# EAGLE design lief-p0r1 (EAGLE 7.5.0)
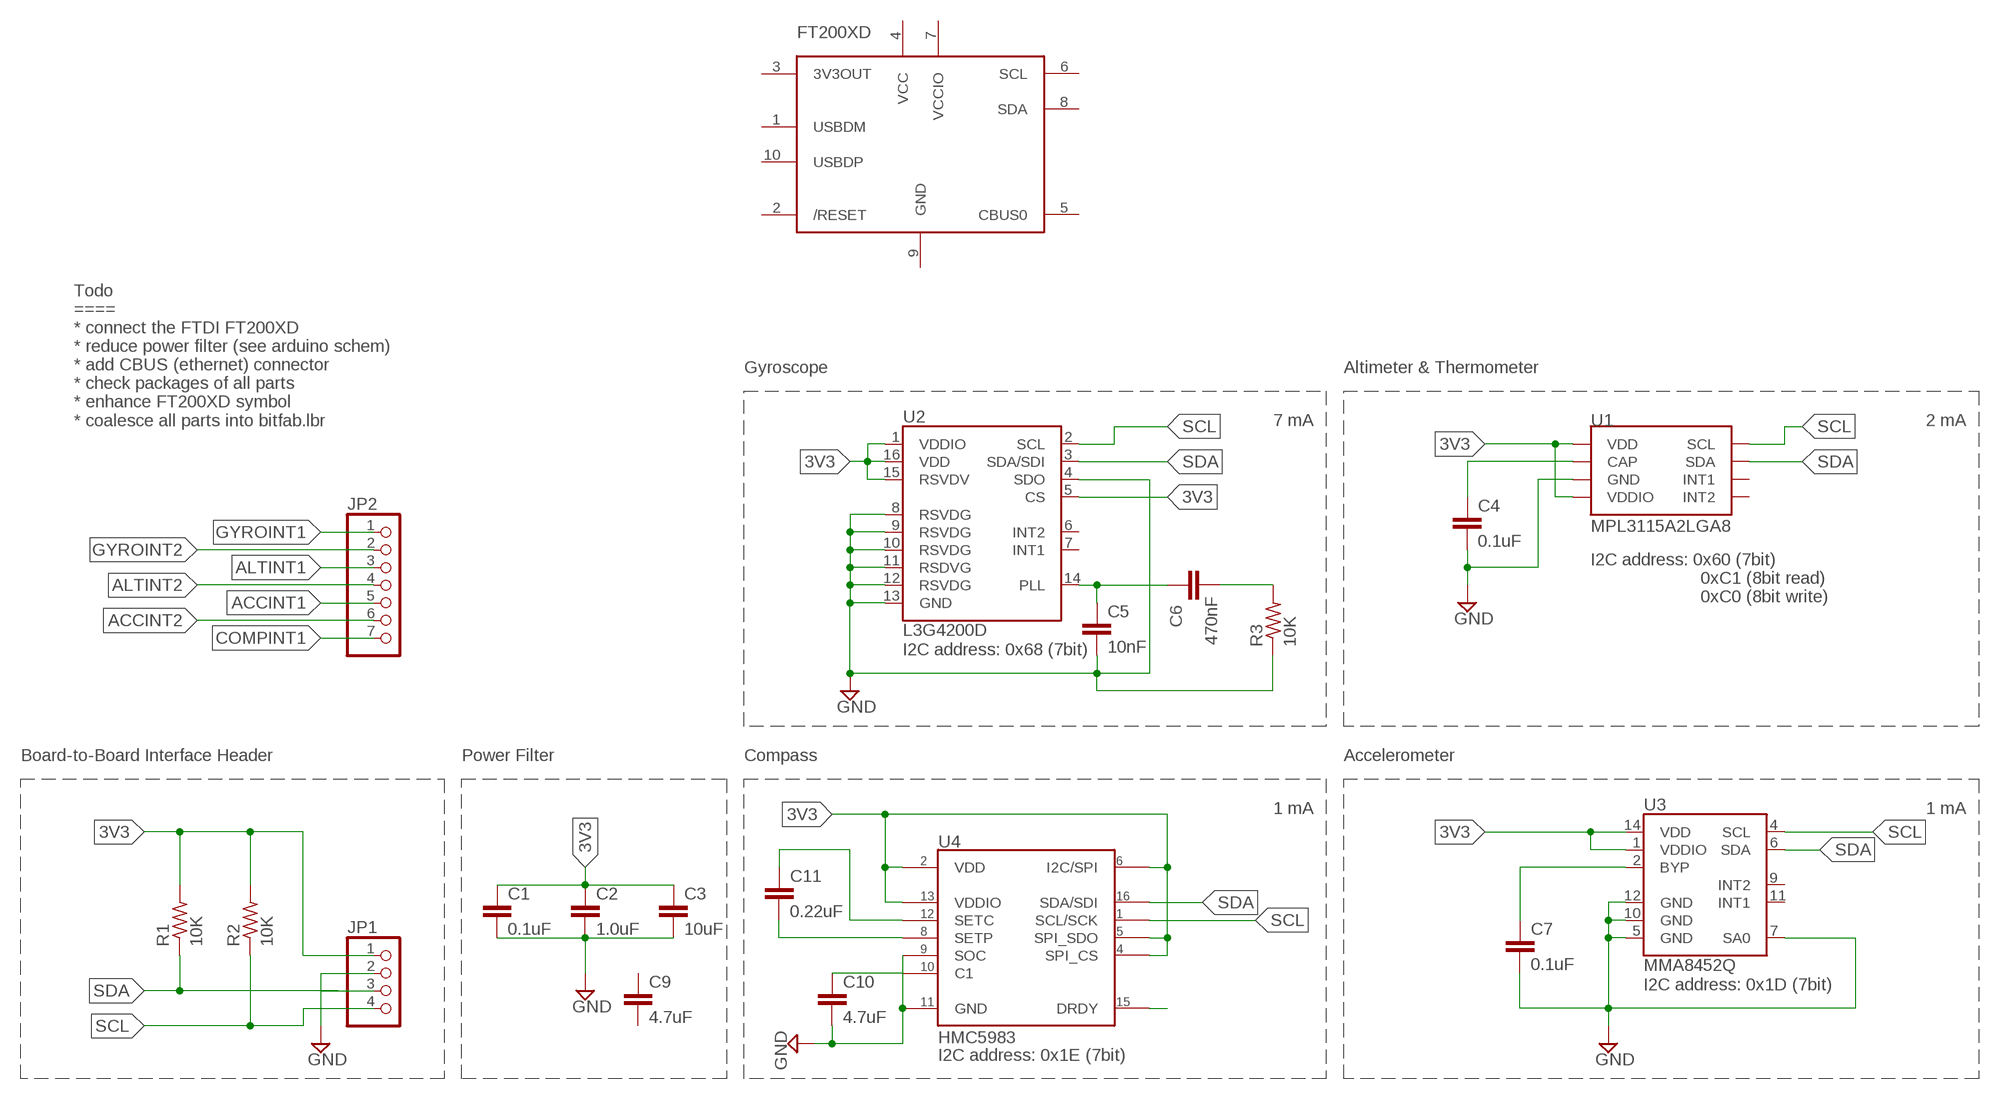
[diagram p0: schematic, sheet 1]

## Parts
C1  0.1uF  0.1UF-25V(+80/-20%)(0603)  [0603-CAP]
C2  1.0uF  1.0UF-25V-+80/-20(0805)"  [0805-CAP]
C3  10uF  1.0UF-25V-+80/-20(0805)"  [0805-CAP]
C4  0.1uF  1.0UF-25V-+80/-20(0805)"  [0805-CAP]
C5  10nF  1.0UF-25V-+80/-20(0805)"  [0805-CAP]
C6  470nF  1.0UF-25V-+80/-20(0805)"  [0805-CAP]
C7  0.1uF  0.1UF-100V-10%(0603)  [0603-CAP]
C9  4.7uF  0.1UF-100V-10%(0603)  [0603-CAP]
C10  4.7uF  1.0UF-25V-+80/-20(0805)"  [0805-CAP]
C11  0.22uF  1.0UF-25V-+80/-20(0805)"  [0805-CAP]
JP1  PINHD-1X4  [1X04]
JP2  PINHD-1X7  [1X07]
R1  10K  R-US_0204/2V  [0204V]
R2  10K  R-US_0204/2V  [0204V]
R3  10K  R-US_0204/2V  [0204V]
U1  MPL3115A2LGA8  [LGA8]
U2  L3G4200D  [LGA16-4X4]
U3  MMA8452Q  [QFN-16_0.5MM]
U4  HMC5983  [HMC5983-LPCC16]
U$1  FT200XD  [DFN-10]

## Nets
3V3: C1.1 C2.1 C3.1 JP1.1 R1.2 R2.2 U1.1(VDD) U1.4(VDDIO) U2.1(VDDIO) U2.5(CS) U2.15(RSVDV) U2.16(VDD) U3.1(VDDIO) U3.14(VDD) U4.I2C/SPI U4.SPI_CS/S1(SPI_CS) U4.SPI_SDO U4.VDD U4.VDDIO
ACCINT1: JP2.5
ACCINT2: JP2.6
ALTINT1: JP2.3
ALTINT2: JP2.4
COMPINT1: JP2.7
GND: C1.2 C2.2 C3.2 C4.2 C5.2 C7.2 C10.2 JP1.2 JP1.3 R3.1 U1.3(GND) U2.4(SDO) U2.8(RSVDG) U2.9(RSVDG) U2.10(RSVDG) U2.11(RSDVG) U2.12(RSVDG) U2.13(GND) U3.5(GND) U3.7(SA0) U3.10(GND) U3.12(GND) U4.GND U4.SOC
GYROINT1: JP2.1
GYROINT2: JP2.2
N$5: C11.1 U4.SETC
N$6: C4.1 U1.2(CAP)
N$7: C6.2 R3.2
N$8: C5.1 C6.1 U2.14(PLL)
N$9: C7.1 U3.2(BYP)
N$10: C11.2 U4.SETP
N$12: C10.1 U4.C1
N$19: U4.DRDY
SCL: JP1.4 R2.1 U1.8(SCL) U2.2(SCL) U3.4(SCL) U4.SCL/SPI_SCK(SCL/SCK)
SDA: R1.1 U1.7(SDA) U2.3(SDA/SDI) U3.6(SDA) U4.SDA/SPI_SDI(SDA/SDI)
Unconnected: C9.1 C9.2 U1.5(INT2) U1.6(INT1) U2.6(INT2) U2.7(INT1) U3.9(INT2) U3.11(INT1) U$1.1(USBDM) U$1.2(/RESET) U$1.3(3V3OUT) U$1.4(VCC) U$1.5(CBUS0) U$1.6(SCL) U$1.7(VCCIO) U$1.8(SDA) U$1.9(GND) U$1.10(USBDP)

## Notes on the sheet
- FT200XD
- Gyroscope | Altimeter & Thermometer
- Todo
  ====
  * connect the FTDI FT200XD
  * reduce power filter (see arduino schem)
  * add CBUS (ethernet) connector
  * check packages of all parts
  * enhance FT200XD symbol
  * coalesce all parts into bitfab.lbr
- 7 mA | 2 mA
- I2C address: 0x60 (7bit)
                        0xC1 (8bit read)
                        0xC0 (8bit write)
- I2C address: 0x68 (7bit)
- Board-to-Board Interface Header | Power Filter | Compass | Accelerometer
- 1 mA | 1 mA
- I2C address: 0x1D (7bit)
- I2C address: 0x1E (7bit)

## Library data of the parts
C1 = SparkFun-Capacitors:0.1UF-25V(+80/-20%)(0603): CAP-00810 Ceramic Standard decoupling cap; PROD_ID: CAP-00810
C2 = SparkFun-Capacitors:1.0UF-25V-+80/-20(0805): CAP-11625; PROD_ID: CAP-11625
C3-C6 C10 C11 = SparkFun-Capacitors:1.0UF-25V-+80/-20(0805): CAP-11625; PROD_ID: CAP-11625; VALUE: 1.0uF
C7 = SparkFun-Capacitors:0.1UF-100V-10%(0603): CAP-08390; PROD_ID: CAP-08390
C9 = SparkFun-Capacitors:0.1UF-100V-10%(0603): CAP-08390; PROD_ID: CAP-08390; VALUE: 0.1uF
JP1 = pinhead:PINHD-1X4: PIN HEADER
JP2 = pinhead:PINHD-1X7: PIN HEADER
R1-R3 = resistor:R-US_: RESISTOR, American symbol
U1 = SparkFun-Sensors:MPL3115A2: Altimeter/Pressure Sensor, I2C, 1.95V-3.6V supply, 50 to 110kPa; PROD_ID: IC-10869
U2 = SparkFun-Sensors:L3G4200D: L3G4200D Three-axis, digital output gyroscope The L3G4200D is a low-power three-axis angular rate sensor, has a full scale of ±250/±500/±2000 dps and is capable of measuring rates with a user-selectable bandwidth. It includes a sensing element and an IC interface capable of providing the measured angular rate to the external world through a digital interface (I2C/SPI). Package: 4x4x1.1 LGA-16 (LGA16-4x4.PAC)
U3 = SparkFun-Sensors:MMA8452Q: MMA8452Q 3-Axis, 12/8-bit Digital Accelerometer Supply Voltage: 1.6-3.6V Range: +/- 2g, 4g, 8g Interface: I2C, 12-bit and 8-bit ODR: 1.56 Hz - 800 Hz Package: QFN-16 http://cache.freescale.com/files/sensors/doc/data_sheet/MMA8452Q.pdf; PROD_ID: IC-10769
U4 = bitfab:HMC5983: HMC5983 - 3-Axis Digital Compass IC VDD MIN: 2.16V, TYP: 2.5V, MAX: 3.6V, ABSMAX: 4.8V 3.0x3.0x0.9mm LCC Surface Mount Package
U$1 = Synapseware:FT200XD

## Board
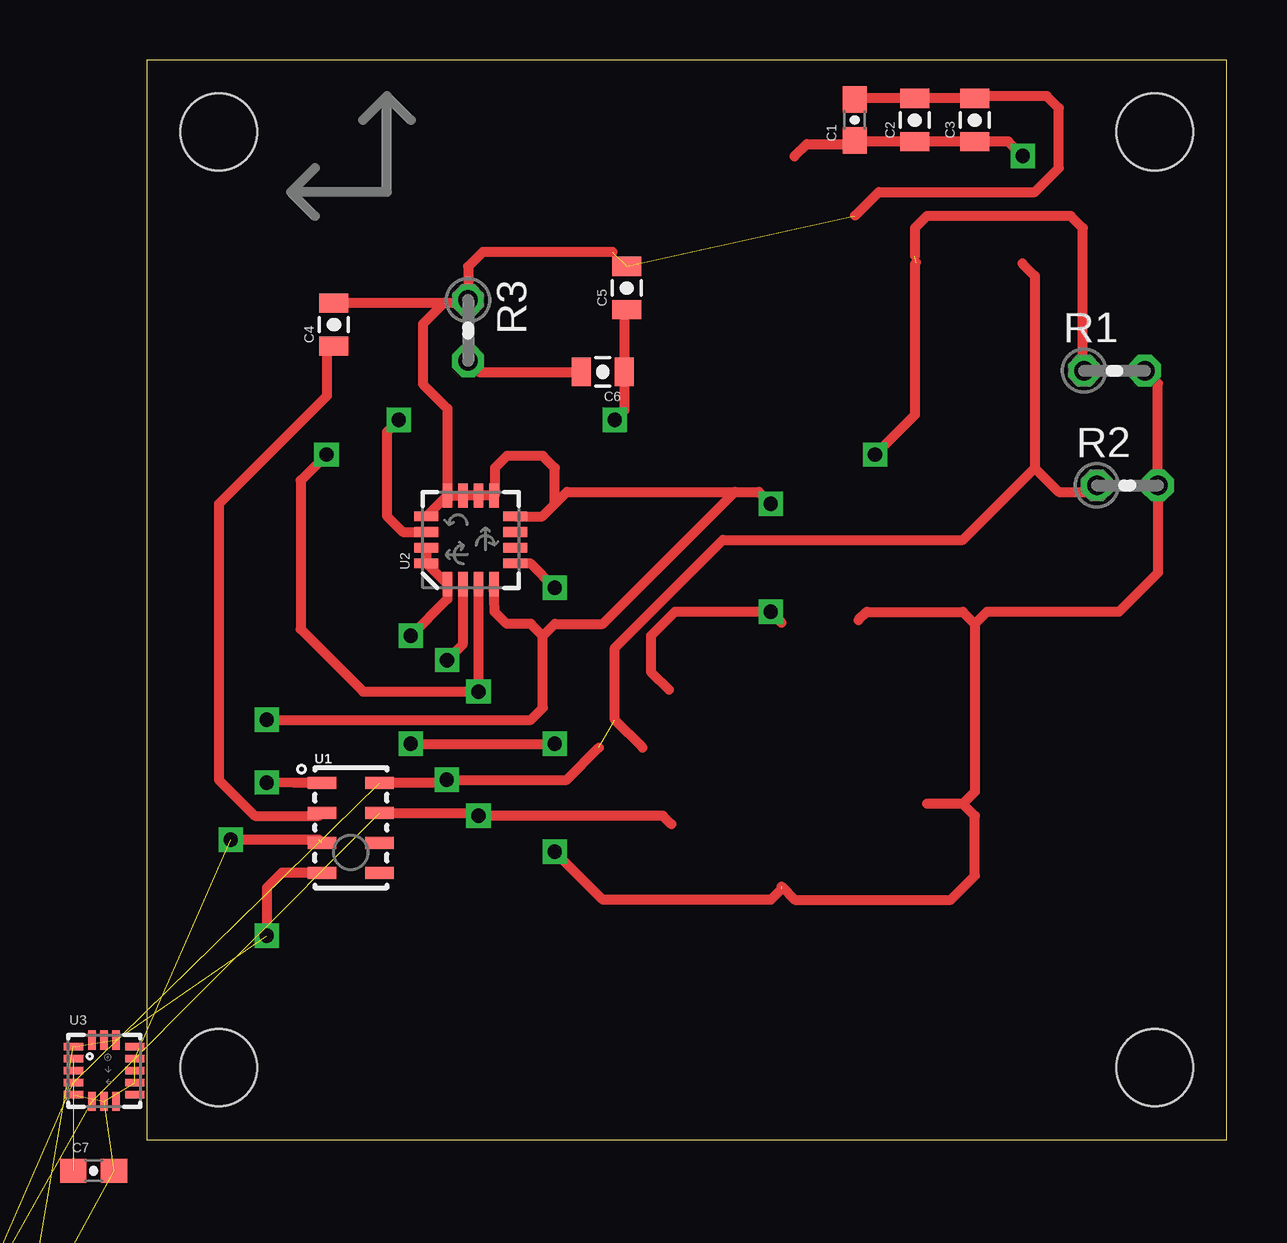
[diagram p1: board, top side]
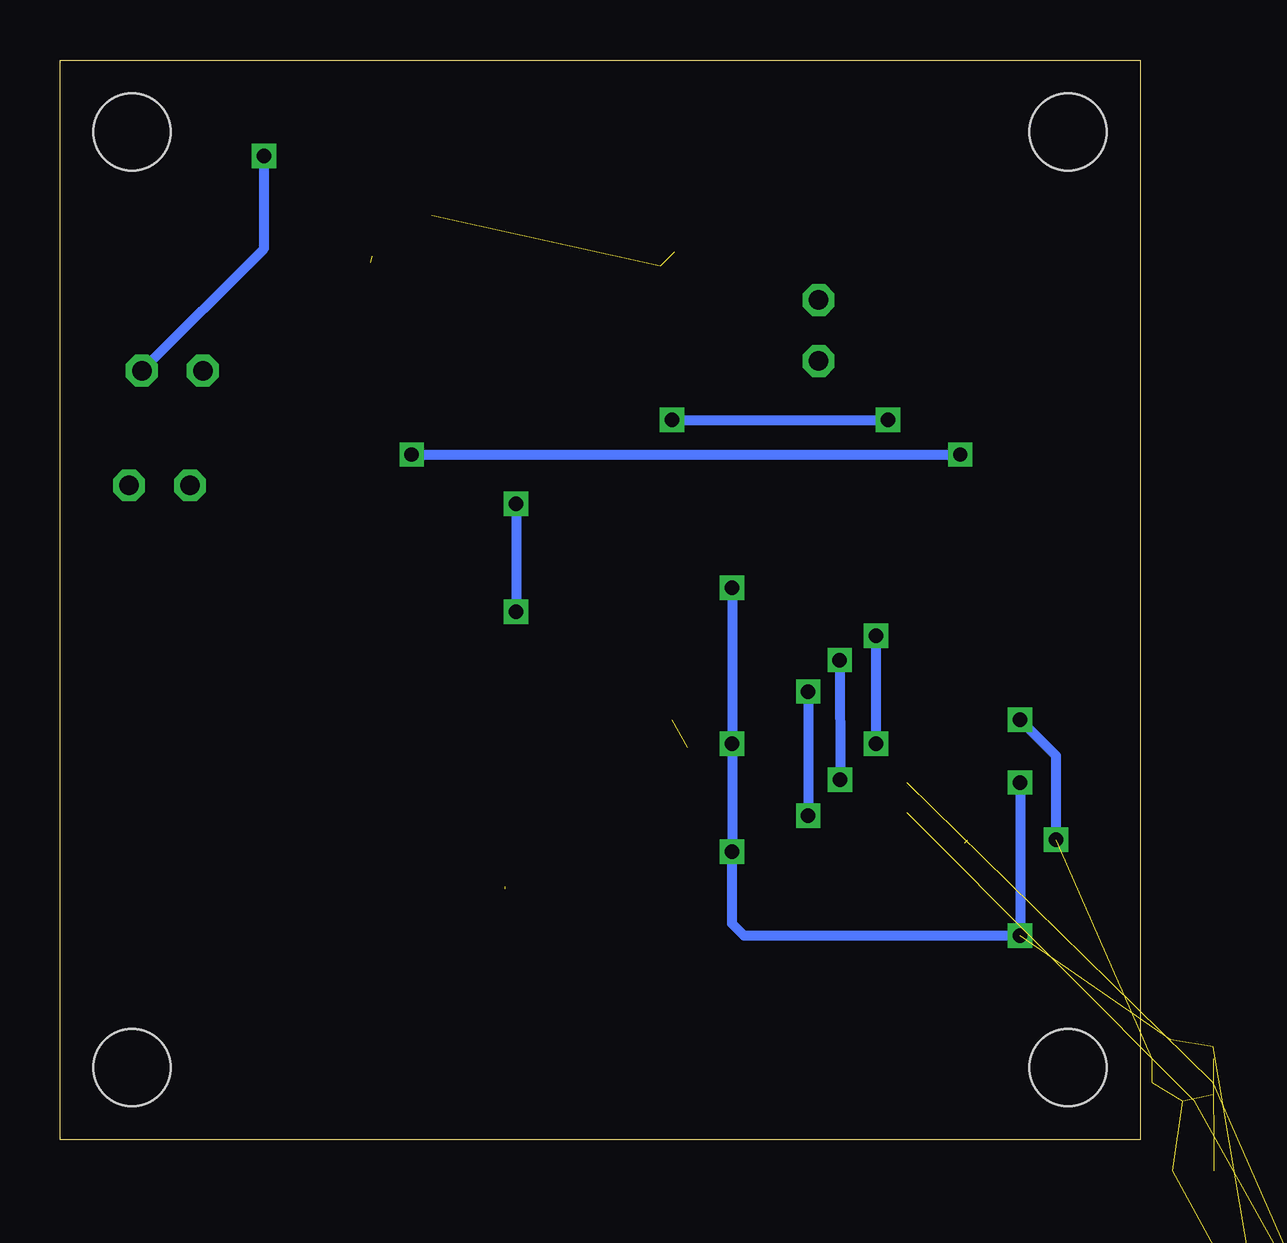
[diagram p2: board, bottom side, seen from below]

Size 45 x 45 mm. Coordinates in mm from the lower left corner, seen from the top.
Outline: 0,0 45,0 45,45 0,45 0,0
Copper layers (1*16): Top 0.035mm / dielectric 1.5mm / Bottom 0.035mm
Design rules "default *": minimum track width 10mil, minimum drill 7mil, track to track 8mil, track to pad 8mil, pad to pad 8mil, via to via 8mil, smd to smd 8mil, copper to edge 40mil, drill to drill 8mil, minimum pad ring 10mil, minimum via ring 8mil, stop-mask expansion 4mil, vias tented up to drill 0mil, thermal gap 10mil
Holes 3.2 mm at 3,3 42,3 42,42 3,42

### Footprints (pad centres in the part's own frame; a part is rotated, then mirrored left to right if it is on the bottom)
0603-CAP = smd 1.1 x 1: 1 -0.85,0; 2 0.85,0
0805-CAP = smd 0.8 x 1.2: 1 -0.9,0; 2 0.9,0
1X04 = drill 1.016 long: 1 -3.81,0; 2 -1.27,0; 3 1.27,0; 4 3.81,0
1X07 = drill 1.016 long: 1 -7.62,0; 2 -5.08,0; 3 -2.54,0; 4 0,0; 5 2.54,0; 6 5.08,0; 7 7.62,0
0204V = drill 0.813 octagon: 1 -1.27,0; 2 1.27,0
LGA8 = smd 1.2 x 0.5: 1 -1.2,1.875; 2 -1.2,0.625; 3 -1.2,-0.625; 4 -1.2,-1.875; 5 1.2,-1.875; 6 1.2,-0.625; 7 1.2,0.625; 8 1.2,1.875
LGA16-4X4 = smd 1 x 0.4: 1 -1.85,0.975; 2 -1.85,0.325; 3 -1.85,-0.325; 4 -1.85,-0.975; 9 1.85,-0.975; 10 1.85,-0.325; 11 1.85,0.325; 12 1.85,0.975 | smd 0.4 x 1: 5 -0.975,-1.85; 6 -0.325,-1.85; 7 0.325,-1.85; 8 0.975,-1.85; 13 0.975,1.85; 14 0.325,1.85; 15 -0.325,1.85; 16 -0.975,1.85
QFN-16_0.5MM = smd 0.8 x 0.3: 1 -1.275,1; 2 -1.275,0.5; 3 -1.275,0; 4 -1.275,-0.5; 5 -1.275,-1; 9 1.275,-1; 10 1.275,-0.5; 11 1.275,0; 12 1.275,0.5; 13 1.275,1 | smd 0.3 x 0.8: 6 -0.5,-1.275; 7 0,-1.275; 8 0.5,-1.275; 14 0.5,1.275; 15 0,1.275; 16 -0.5,1.275
HMC5983-LPCC16 = smd 0.45 x 0.3: C1 1.275,-0.25; GND 1.275,0.25; NC1 -1.275,-0.25; SCL/SPI_SCK -1.275,0.75; SETC 1.275,0.75; SOC 1.275,-0.75; SPI_CS/S1 -1.275,-0.75; VDD -1.275,0.25 | smd 0.3 x 0.45: DRDY -0.25,1.275; I2C/SPI -0.25,-1.275; NC2 0.25,-1.275; NC3 0.25,1.275; SDA/SPI_SDI -0.75,1.275; SETP 0.75,-1.275; SPI_SDO -0.75,-1.275; VDDIO 0.75,1.275
DFN-10 = smd 0.25 x 0.7: 1 0.54,-2.85; 2 1.02,-2.85; 3 1.49,-2.85; 4 1.97,-2.85; 5 2.45,-2.85; 6 2.45,-0.16; 7 1.97,-0.16; 8 1.5,-0.16; 9 1.02,-0.16; 10 0.54,-0.16

### Placement (x,y rotation side)
C1  29.5,42.5 90 top
C2  32,42.5 90 top
C3  34.5,42.5 90 top
C4  7.79,33.97 90 top
C5  20,35.5 90 top
C6  19,32 180 top
C7  -2.21,-1.3 0 top
C9  -2.21,-7.21 0 top  (outside the outline)
C10  -8.78,-6.96 0 top  (outside the outline)
C11  -11.72,-6.96 0 top  (outside the outline)
JP1  -7.58,-12.39 0 top  (outside the outline)
JP2  -3.77,-17.97 0 top  (outside the outline)
R1  40.32,32.05 0 top
R2  40.85,27.27 0 top
R3  13.39,33.72 270 top
U1  8.5,13 0 top
U2  13.5,25 90 top
U3  -1.78,2.88 0 top
U4  -5.34,-6.5 0 top  (outside the outline)
U$1  -12.93,-20.34 0 top  (outside the outline)

### Tracks (layer width: path | path; a pad name or v marks a point on that pad's centre or on a via)
3V3  (via drill 0.6)  (9 unrouted)
  Top 0.406: 26.45,10.55 27,10 33.5,10 34.5,11 34.5,13.5 34,14 | 34,14 32.51,14 | 29.65,21.65 30,22 34,22 34.5,21.5 | 34.5,21.5 34.5,14.5 34,14 | 34.5,21.5 35,22 40.5,22 42.12,23.62 R2.2 42.12,31.52 R1.2 | 32.08,41.63 C2.1 | C2.1 C3.1 35.9,41.6 v36.5,41 | C2.1 29.55,41.6 C1.1 29.35,41.5 27.5,41.5 26.98,40.98 | U2.5 15.97,24.02 v17,23 | 26.45,10.45 26,10 19,10 v17,12 | U1.4 5.62,11.12 5,10.5 v5,8.5 | U1.1 6.12,14.88 v5,14.88 | U2.15 U2.16 U2.1 12.53,22.52 v11,21 | v11,16.5 v17,16.5
  Bottom 0.406: v17,23 v17,16.5 v17,12 17,9 16.5,8.5 v5,8.5 v5,14.88 | R1.2 36.5,37.14 v36.5,41 | v11,16.5 v11,21
GND  (via drill 0.6)  (13 unrouted)
  Top 0.406: 32.08,43.44 C2.2 | 29.52,38.52 30.5,39.5 37,39.5 38,40.5 38,43 37.5,43.5 34.6,43.5 C3.2 C2.2 | C2.2 29.55,43.4 C1.2 | 19.4,37 14,37 13.39,36.39 R3.1 13.27,34.87 12.37,34.87 | 12.37,34.87 C4.2 | 12.37,34.87 11.5,34 11.5,31.5 12.53,30.48 U2.12 | U2.8 16.48,25.98 17,26.5 | 17,26.5 17,28 16.5,28.5 15,28.5 14.5,28 14.5,26.88 U2.9 U2.10 U2.11 U2.12 | U2.12 U2.13 | 26.45,21.55 v26,22 22,22 21,21 21,19.5 21.76,18.74 | 17,26.5 17.5,27 24.5,27 | 24.5,27 25.5,27 v26,26.5 | 7.17,12.5 v3.5,12.5 | v5,17.5 16,17.5 16.5,18 16.5,21 | 16.5,21 16,21.5 15,21.5 14.49,22 14.46,23.12 U2.4 | 16.5,21 17,21.5 19,21.5 24.5,27
  Bottom 0.406: v26,26.5 v26,22 | v3.5,12.5 3.5,16 v5,17.5
N$5  (1 unrouted)
N$6
  Top 0.406: C4.1 7.5,32.77 7.5,31 3,26.5 3,15 4.5,13.5 7.17,13.5 U1.2
N$7
  Top 0.406: R3.2 13.84,32 C6.2
N$8  (via drill 0.6)
  Top 0.406: C5.1 19.9,34.5 C6.1 19.9,30.4 v19.5,30 | v10.5,30 10,29.5 10,26 10.68,25.32 U2.14
  Bottom 0.406: v19.5,30 v10.5,30
N$9  (1 unrouted)
N$10  (1 unrouted)
N$12  (1 unrouted)
SCL  (via drill 0.6)  (4 unrouted)
  Top 0.406: 36.49,36.51 37,36 37,28 | 37,28 38,27 39.32,27 R2.1 | U2.2 13.16,20.63 v12.52,19.98 | U1.8 12.38,14.88 v12.5,15 17.5,15 18.84,16.34 | 20.66,16.34 19.5,17.5 19.5,20.5 24,25 34,25 37,28
  Bottom 0.406: v12.52,19.98 v12.5,15
SDA  (via drill 0.6)  (3 unrouted)
  Top 0.406: R1.1 39,32 39,38 38.5,38.5 32.5,38.5 32,38 32,36.83 | 32.06,36.56 32,36.5 32,32.05 | U1.7 13.7,13.62 arc-90 v13.82,13.5 21.5,13.5 21.86,13.14 | 32,32.05 32.02,32.03 | 32,32.05 32,30.2 v30.35,28.55 | v7.49,28.55 6.42,27.48 6.42,21.28 9.02,18.68 v13.82,18.68 U2.3
  Bottom 0.406: v13.82,18.68 v13.82,13.5 | v30.35,28.55 v7.49,28.55

### Text on the board
tDocu: x | y